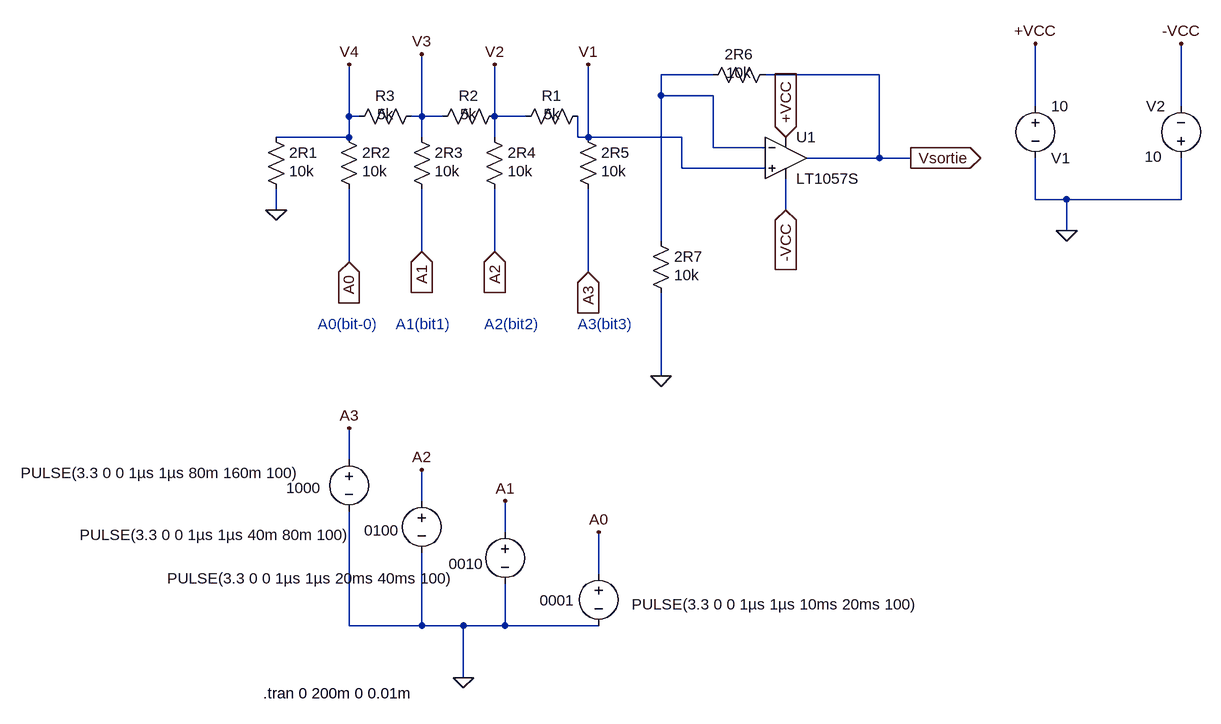
[diagram p0: schematic ltspices-pmodVGA.asc]
ltspices-pmodVGA.asc, the LTspice schematic file:
Version 4
SHEET 1 1924 1032
WIRE 768 64 688 64
WIRE 1024 64 848 64
WIRE 688 96 688 64
WIRE 768 96 688 96
WIRE 1264 112 1264 16
WIRE 1488 112 1488 16
WIRE 208 128 208 48
WIRE 224 128 208 128
WIRE 320 128 320 32
WIRE 320 128 304 128
WIRE 352 128 320 128
WIRE 432 128 432 48
WIRE 480 128 432 128
WIRE 208 160 208 128
WIRE 208 160 96 160
WIRE 320 160 320 128
WIRE 432 160 432 128
WIRE 560 160 560 128
WIRE 576 160 576 48
WIRE 576 160 560 160
WIRE 720 160 576 160
WIRE 768 176 768 96
WIRE 848 176 768 176
WIRE 1024 192 1024 64
WIRE 1024 192 912 192
WIRE 1072 192 1024 192
WIRE 720 208 720 160
WIRE 848 208 720 208
WIRE 1264 256 1264 192
WIRE 1312 256 1264 256
WIRE 1488 256 1488 192
WIRE 1488 256 1312 256
WIRE 96 272 96 240
WIRE 880 272 880 224
WIRE 1312 304 1312 256
WIRE 688 320 688 96
WIRE 320 336 320 240
WIRE 432 336 432 240
WIRE 208 352 208 240
WIRE 576 368 576 240
WIRE 688 528 688 400
WIRE 208 656 208 608
WIRE 320 720 320 672
WIRE 448 768 448 720
WIRE 592 832 592 768
WIRE 208 912 208 736
WIRE 320 912 320 800
WIRE 320 912 208 912
WIRE 384 912 320 912
WIRE 448 912 448 848
WIRE 448 912 384 912
WIRE 592 912 448 912
WIRE 384 992 384 912
FLAG 96 272 0
FLAG 1072 192 Vsortie
IOPIN 1072 192 Out
FLAG 688 528 0
FLAG 576 48 V1
FLAG 208 48 V4
FLAG 320 32 V3
FLAG 432 48 V2
FLAG 880 160 +VCC
IOPIN 880 160 In
FLAG 880 272 -VCC
IOPIN 880 272 In
FLAG 1312 304 0
FLAG 1264 16 +VCC
FLAG 1488 16 -VCC
FLAG 384 992 0
FLAG 208 608 A3
FLAG 320 672 A2
FLAG 448 720 A1
FLAG 592 768 A0
FLAG 208 352 A0
IOPIN 208 352 In
FLAG 320 336 A1
IOPIN 320 336 In
FLAG 432 336 A2
IOPIN 432 336 In
FLAG 576 368 A3
IOPIN 576 368 In
SYMBOL res 80 144 R0
WINDOW 3 36 68 Left 2
SYMATTR InstName 2R1
SYMATTR Value 10k
SYMBOL res 192 144 R0
WINDOW 3 36 68 Left 2
SYMATTR InstName 2R2
SYMATTR Value 10k
SYMBOL res 304 144 R0
WINDOW 3 36 68 Left 2
SYMATTR InstName 2R3
SYMATTR Value 10k
SYMBOL res 416 144 R0
WINDOW 3 36 68 Left 2
SYMATTR InstName 2R4
SYMATTR Value 10k
SYMBOL res 560 144 R0
WINDOW 3 36 68 Left 2
SYMATTR InstName 2R5
SYMATTR Value 10k
SYMBOL res 320 112 R90
WINDOW 0 0 56 VBottom 2
WINDOW 3 28 56 VBottom 2
SYMATTR InstName R3
SYMATTR Value 5k
SYMBOL res 448 112 R90
WINDOW 0 0 56 VBottom 2
WINDOW 3 28 56 VBottom 2
SYMATTR InstName R2
SYMATTR Value 5k
SYMBOL res 576 112 R90
WINDOW 0 0 56 VBottom 2
WINDOW 3 28 56 VBottom 2
SYMATTR InstName R1
SYMATTR Value 5k
SYMBOL res 864 48 R90
WINDOW 0 0 56 VBottom 2
WINDOW 3 28 56 VBottom 2
SYMATTR InstName 2R6
SYMATTR Value 10k
SYMBOL res 672 304 R0
WINDOW 3 36 68 Left 2
SYMATTR InstName 2R7
SYMATTR Value 10k
SYMBOL OpAmps\\LT1057S 880 128 R0
SYMATTR InstName U1
SYMBOL voltage 208 640 R0
WINDOW 0 -97 60 Left 2
WINDOW 3 -505 37 Left 2
WINDOW 123 0 0 Left 0
WINDOW 39 0 0 Left 0
SYMATTR InstName 1000
SYMATTR Value PULSE(3.3 0 0 1µs 1µs 80m 160m 100)
SYMBOL voltage 320 704 R0
WINDOW 0 -89 61 Left 2
WINDOW 3 -526 68 Left 2
WINDOW 123 0 0 Left 0
WINDOW 39 0 0 Left 0
SYMATTR InstName 0100
SYMATTR Value PULSE(3.3 0 0 1µs 1µs 40m 80m 100)
SYMBOL voltage 448 752 R0
WINDOW 0 -87 65 Left 2
WINDOW 3 -520 87 Left 2
WINDOW 123 0 0 Left 0
WINDOW 39 0 0 Left 0
SYMATTR InstName 0010
SYMATTR Value PULSE(3.3 0 0 1µs 1µs 20ms 40ms 100)
SYMBOL voltage 592 816 R0
WINDOW 0 -91 57 Left 2
WINDOW 3 51 63 Left 2
WINDOW 123 0 0 Left 0
WINDOW 39 0 0 Left 0
SYMATTR InstName 0001
SYMATTR Value PULSE(3.3 0 0 1µs 1µs 10ms 20ms 100)
SYMBOL voltage 1488 208 R180
WINDOW 0 24 96 Left 2
WINDOW 3 29 18 Left 2
WINDOW 123 0 0 Left 0
WINDOW 39 24 -12 Left 2
SYMATTR InstName V2
SYMATTR Value 10
SYMBOL voltage 1264 96 R0
WINDOW 0 24 96 Left 2
WINDOW 3 24 16 Left 2
WINDOW 123 0 0 Left 0
WINDOW 39 0 0 Left 0
SYMATTR InstName V1
SYMATTR Value 10
TEXT 160 448 Left 2 ;A0(bit-0)
TEXT 280 448 Left 2 ;A1(bit1)
TEXT 416 448 Left 2 ;A2(bit2)
TEXT 560 448 Left 2 ;A3(bit3)
TEXT 76 1016 Left 2 !.tran 0 200m 0 0.01m

The netlist it stands for:
* ltspices-pmodVGA.asc
R§2R1 V4 0 10k
R§2R2 V4 A0 10k
R§2R3 V3 A1 10k
R§2R4 V2 A2 10k
R§2R5 V1 A3 10k
R3 V3 V4 5k
R2 V2 V3 5k
R1 V1 V2 5k
R§2R6 Vsortie N001 10k
R§2R7 N001 0 10k
XU1 V1 N001 +VCC -VCC Vsortie LT1057S  ; pins In+ In- V+ V- OUT
V§1000 A3 0 PULSE(3.3 0 0 1µs 1µs 80m 160m 100)
V§0100 A2 0 PULSE(3.3 0 0 1µs 1µs 40m 80m 100)
V§0010 A1 0 PULSE(3.3 0 0 1µs 1µs 20ms 40ms 100)
V§0001 A0 0 PULSE(3.3 0 0 1µs 1µs 10ms 20ms 100)
V2 0 -VCC 10
V1 +VCC 0 10
* A0(bit-0)
* A1(bit1)
* A2(bit2)
* A3(bit3)
.tran 0 200m 0 0.01m
.backanno
.end